# Altium schematic sheet BRIDGE-ACCELEROMETER.SchDoc
size A3; CheckedBy: José Ogando; Engineer: Eduardo Teofilo; Revision: A2; SheetNumber: 4; SheetTotal: 8
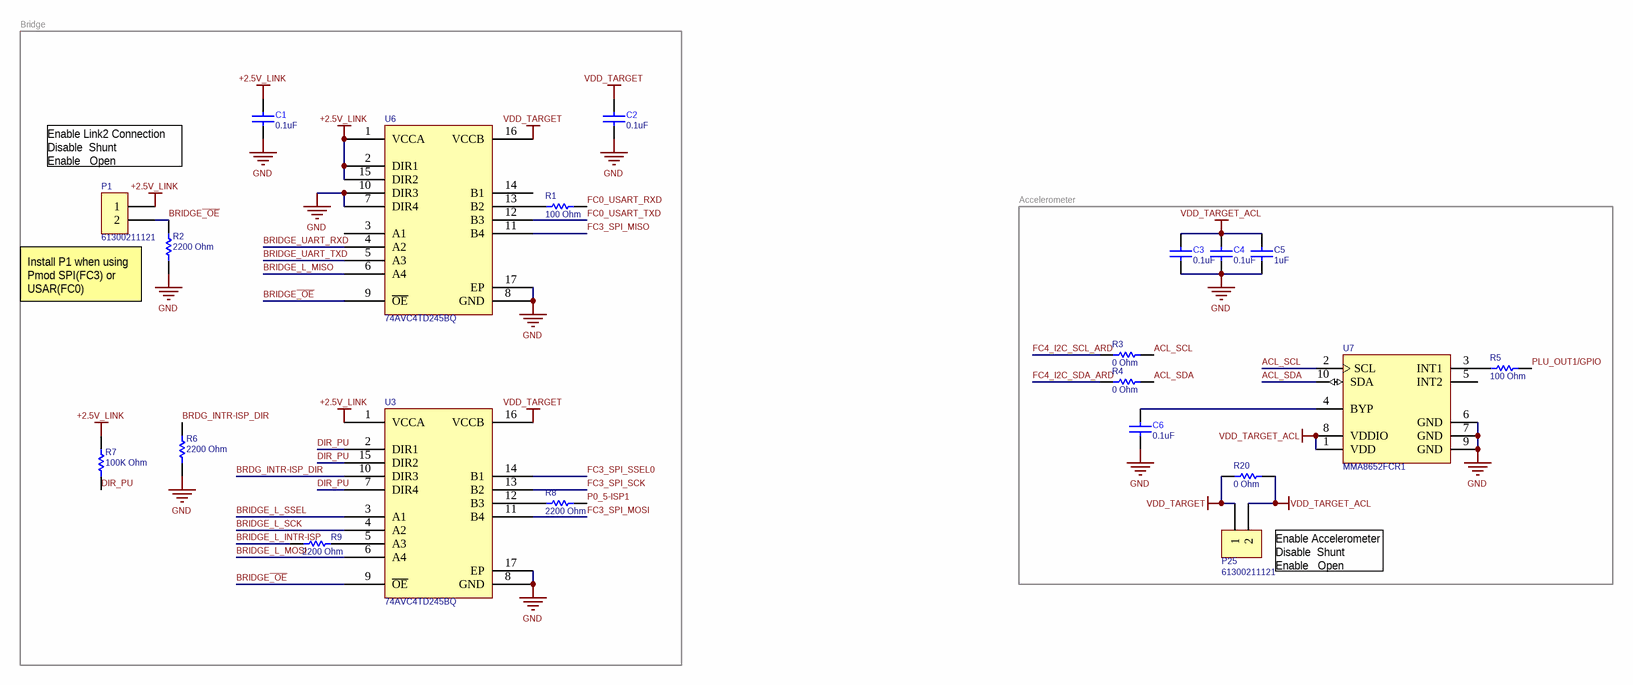
[diagram p0: BRIDGE-ACCELEROMETER.SchDoc]

## Parts
C1  value 0.1uF  [CAPC1005]  (hidden comment: CC0402KRX7R7BB104)
C2  value 0.1uF  [CAPC1005]  (hidden comment: CC0402KRX7R7BB104)
C3  value 0.1uF  [CAPC1005]  (hidden comment: CC0402KRX7R7BB104)
C4  value 0.1uF  [CAPC1005]  (hidden comment: CC0402KRX7R7BB104)
C5  value 1uF  [CAPC0402(1005)60_L]  (hidden comment: CAP 1uF 10V 0402(1005))
C6  value 0.1uF  [CAPC1005]  (hidden comment: CC0402KRX7R7BB104)
P1  61300211121  [61300211121]
P25  61300211121  [61300211121]
R1  value 100 Ohm  [RESC0402(1005)_L]  (hidden comment: 100R 5% 0402(1005))
R2  value 2200 Ohm  [RESC0402(1005)_L]  (hidden comment: 2K2 1% 0402(1005))
R3  value 0 Ohm  [RESC0402(1005)_L]  (hidden comment: Jumper 0402(1005))
R4  value 0 Ohm  [RESC0402(1005)_L]  (hidden comment: Jumper 0402(1005))
R5  value 100 Ohm  [RESC0402(1005)_L]  (hidden comment: 100R 5% 0402(1005))
R6  value 2200 Ohm  [RESC0402(1005)_L]  (hidden comment: 2K2 1% 0402(1005))
R7  value 100K Ohm  [RESC1005X40X25LL05T05]  (hidden comment: ERJ-2RKF1003X)
R8  value 2200 Ohm  [RESC0402(1005)_L]  (hidden comment: 2K2 1% 0402(1005))
R9  value 2200 Ohm  [RESC0402(1005)_L]  (hidden comment: 2K2 1% 0402(1005))
R20  value 0 Ohm  [RESC0402(1005)_L]  (hidden comment: Jumper 0402(1005))
U3  74AVC4TD245BQ  [DHVQFN16 (NXP)]
U6  74AVC4TD245BQ  [DHVQFN16 (NXP)]
U7  MMA8652FCR1  [FRES-2162-02_V]

## Nets
+2.5V_LINK: C1.1 P1.1 R7.2 U3.1(VCCA) U6.1(VCCA) U6.2(DIR1) U6.15(DIR2)
GND: C1.2 C2.2 C3.2 C4.2 C5.1 C6.2 R2.2 R6.1 U3.8(GND) U3.17(EP) U6.7(DIR4) U6.8(GND) U6.10(DIR3) U6.17(EP) U7.6(GND) U7.7(GND) U7.9(GND)
VDD_TARGET: C2.1 P25.1 R20.2 U3.16(VCCB) U6.16(VCCB)
VDD_TARGET_ACL: C3.1 C4.1 C5.2 P25.2 R20.1 U7.1(VDD) U7.8(VDDIO)
ACL_SCL: R3.1 U7.2(SCL)
ACL_SDA: R4.1 U7.10(SDA)
BRDG_INTR-ISP_DIR: R6.2 U3.10(DIR3)
BRIDGE~{_OE}: P1.2 R2.1 U3.9(~{OE}) U6.9(~{OE})
BRIDGE_L_INTR-ISP: R9.2
BRIDGE_L_MISO: U6.6(A4)
BRIDGE_L_MOSI: U3.6(A4)
BRIDGE_L_SCK: U3.4(A2)
BRIDGE_L_SSEL: U3.3(A1)
BRIDGE_UART_RXD: U6.4(A2)
BRIDGE_UART_TXD: U6.5(A3)
DIR_PU: R7.1 U3.2(DIR1) U3.7(DIR4) U3.15(DIR2)
FC0_USART_RXD: R1.2
FC0_USART_TXD: U6.12(B3)
FC3_SPI_MISO: U6.11(B4)
FC3_SPI_MOSI: U3.11(B4)
FC3_SPI_SCK: U3.13(B2)
FC3_SPI_SSEL0: U3.14(B1)
FC4_I2C_SCL_ARD: R3.2
FC4_I2C_SDA_ARD: R4.2
P0_5-ISP1: R8.1
PLU_OUT1/GPIO: R5.2
NetC6_1: C6.1 U7.4(BYP)
NetR1_1: R1.1 U6.13(B2)
NetR5_1: R5.1 U7.3(INT1)
NetR8_2: R8.2 U3.12(B3)
NetR9_1: R9.1 U3.5(A3)

Not connected (* = marked no-connect by the designer): U6 3(A1) 14(B1); U7 5(INT2)

## Notes on the sheet
- Bridge
- (near P1) Enable Link2 Connection
  Disable  Shunt
  Enable   Open
- Accelerometer
- Install P1 when using Pmod SPI(FC3) or USAR(FC0)
- (near P25) Enable Accelerometer
  Disable  Shunt
  Enable   Open
- Project:
- Sheet:
- Revision:
- Date:
- Size:
- Sheet number:
- Engineer
- Checked by:
- A3
- of
- www.code-ing.com

## Library data of the parts
C1-C4 C6 = CMP-0001-00074-1: Capacitor, Yageo, Ceramic, 0.1uF 10% 16V 0402 (1005) X7R; Polarity: Non-Polarized; ClassName: Board Template Device; Rated Voltage: 16 V; Status: Production; Tolerance: 10 %; Mounting Technology: Surface Mount; Technology: Ceramic; Category: Capacitor; Dielectric: X7R; Publisher: Altium
C5 = CMP-1034-02118-1: CAP 1uF 10V -20% to +80% 0402 (1005 Metric) Thickness 0.6mm SMD; Case-EIA: 0402; Case-Metric: 1005; Tolerance: -20% to +80%; Max Thickness: 0.6 mm; Rated Voltage: 10 V; Technology: SMT
P1 = 61300211121: HEADER 2POS SNGL T/H 2.54MM; Manufacturer: Wurth Electronics Inc; Manufacturer part #: 61300211121; Indications: *; Modified by: *; Value: *; Created by: gmoreno; Creation date: 28-Jul-2012
P25 = 61300211121: HEADER 2POS SNGL T/H 2.54MM; Manufacturer: Wurth Electronics Inc; Indications: DNI; Manufacturer part #: 61300211121; Modified by: *; Value: *; Created by: gmoreno; Creation date: 28-Jul-2012
R1 R5 = CMP-1011-00050-1: 100R 0.063W 5% 0402 (1005 Metric)  SMD; Case-Metric: 1005; Case-EIA: 0402; Power: 0.063 W; Technology: SMT; Tolerance: 5 %
R2 R6 R8 R9 = CMP-1011-00546-1: 2K2 0.063W 1% 0402 (1005 Metric)  SMD; Case-Metric: 1005; Case-EIA: 0402; Power: 0.063 W; Tolerance: 1 %; Technology: SMT
R3 R4 R20 = CMP-1011-00001-1: Jumper 0402 (1005 Metric); Tolerance: None; Case-Metric: 1005; Case-EIA: 0402; Power: None; Technology: SMT
R7 = CMP-2002-00608-3: Chip Resistor, 100 KOhm, +/- 1%, 100 mW, -55 to 155 degC, 0402 (1005 Metric), RoHS, Tape and Reel; Manufacturer: Basic Passives; Power Rating: 100 mW; Voltage Rating: 50 V; Case\/Package: 0402; Case Code (Imperial): 0402; RoHSCompliant: true; Min Operating Temperature: -55 degC; Mount: Surface Mount; Packaging: Tape and Reel; PackageDescription: 2-Pin Surface Mount Device, Body 1 x 0.5 mm; Tolerance: 1%; REACH SVHC: Yes; ComponentLink1URL: http://www.panasonic.com/; ComponentLink1Description: Manufacturer URL; Package Quantity: 10000; Mounting Technology: Surface Mount; DatasheetVersion: 04/2015; PartNumber: ERJ-2RKF1003X; Height: 0.35 mm; Pins: 2; Length: 1 mm; Max Operating Temperature: 155 degC; ComponentLink2Description: Datasheet; ComponentLink2URL: http://industrial.panasonic.com/cdbs/www-data/pdf/RDA0000/AOA0000C86.pdf; PackageReference: 0402; Radiation Hardening: No; Width: 0.5 mm; Case Code (Metric): 1005
U3 U6 = 74AVC4TD245BQ: TXRX 4BIT DUAL 3STATE 16-DHVQFN; Manufacturer: NXP Semiconductors; Created By: Jose; Creation Date: 25-Apr-2016; Modified by: *; Indications: *; Value: *; Manufacturer Part #: 74AVC4TD245BQ
U7 = CMP-1356-00001-1: MMA8652FC 3-Axis, 12-bit Digital Accelerometer, 1.95 to 3.6 V, -40 to 85 degC, 10-Pin DFN (2162-02), RoHS, Tape and Reel; Manufacturer: Freescale Semiconductor; Digital Output: 12 Bits; fSCL: 0 to 400 kHz; Cap: 75 to 470 nF; ComponentLink3URL: http://cache.freescale.com/files/shared/doc/package_info/98ASA00301D.pdf; PartNumber: MMA8652FCR1; VDD: 1.95 to 3.6 V; PackageDescription: 10-Pin Plastic Dual Flat Package, Body 2 x 2 mm, Pitch 0.4 mm; ComponentLink3Description: Package Specification; ComponentLink1Description: Manufacturer URL; RoHS: TRUE; ComponentLink2URL: http://cache.freescale.com/files/sensors/doc/data_sheet/MMA8652FC.pdf?pspll=1; PackageVersion: Rev. A; DatasheetVersion: Rev. 3.2; Mounting Technology: Surface Mount; Packing: Tape and Reel; ComponentLink2Description: Datasheet; Temperature Range: -40 to 85 degC; ComponentLink1URL: http://www.freescale.com/